# Altium schematic sheet cables.SchDoc: Hall / cables
size A4
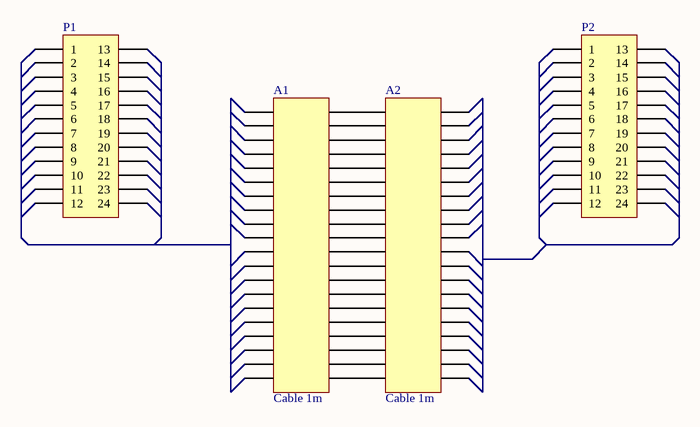
[diagram p0: cables.SchDoc]

## Parts
A1  Cable 1m  [HDR2X20]  (mechanical)
A2  Cable 1m  [HDR2X20]  (mechanical)
P1  wire connector  [HDR2X12_CEN]  (value not drawn)  (mechanical)
P2  wire connector  [HDR2X12_CEN]  (value not drawn)  (mechanical)

## Nets
NetA1_2: A1.2 A2.1
NetA1_4: A1.4 A2.3
NetA1_6: A1.6 A2.5
NetA1_8: A1.8 A2.7
NetA1_10: A1.10 A2.9
NetA1_12: A1.12 A2.11
NetA1_14: A1.14 A2.13
NetA1_16: A1.16 A2.15
NetA1_18: A1.18 A2.17
NetA1_20: A1.20 A2.19
NetA1_22: A1.22 A2.21
NetA1_24: A1.24 A2.23
NetA1_26: A1.26 A2.25
NetA1_28: A1.28 A2.27
NetA1_30: A1.30 A2.29
NetA1_32: A1.32 A2.31
NetA1_34: A1.34 A2.33
NetA1_36: A1.36 A2.35
NetA1_38: A1.38 A2.37
NetA1_40: A1.40 A2.39

Not connected (* = marked no-connect by the designer): A1 1 3 5 7 9 11 13 15 17 19 21 23 25 27 29 31 33 35 37 39; A2 2 4 6 8 10 12 14 16 18 20 22 24 26 28 30 32 34 36 38 40; P1 1 2 3 4 5 6 7 8 9 10 11 12 13 14 15 16 17 18 19 20 21 22 23 24; P2 1 2 3 4 5 6 7 8 9 10 11 12 13 14 15 16 17 18 19 20 21 22 23 24

## Notes on the sheet
- Title
- Size:
- Date:
- A4
- Number:
- Time:
- Revision:
- Sheet
- of
- Fermium LABS srl
- Via Monselice 15a
- 35142 Padova PD
- Italy
- File:

## Library data of the parts
A1 A2 = Header 20X2: cable, 1 meter; Manufacturer: HELUKABEL; Manufacturer Part Number: 21041; Unit: m; SuppliedAmount: 0; MinAmount: 5; Wire type: data transmission; Core structure: stranded; Core type: Cu; Number of cores: 20; No. of pairs: 10; Core section: 0.25mm<sup>2</sup>; Core marking: colours with colour repetition; Shield structure: tinned copper braid; Outer insulation material: PVC; Outside diameter: 10.6mm; Rated voltage: 350V; Wire series: LiYCY-P; Resistance to: most of oils; Cable features: twisted pair conductors; LatestRevisionDate: 17-Jul-2002; LatestRevisionNote: Re-released for DXP Platform.; Publisher: Altium Limited; Supplier 1: TME; Supplier Part Number 1: LIYCYP10X2X0.25; Category: Multicore Cables - Shielded; Stock 1: 105; Pricing 1: 5=3.35, 25=2.87, 50=2.56, 100=2.24 (EUR); Weight: 234; Multiples: 5; Insulation colour: grey; Operating temperature: -30...80°C; Flexibility class: 5; Price Type: NET; ComponentLink1URL: http://static.tme.eu/products_pics/6/d/b/6db3d8d6d88e3d48e6a1056796f437cb/283083.jpg; ComponentLink1Description: http://static.tme.eu/products_pics/6/d/b/6db3d8d6d88e3d48e6a1056796f437cb/283083.jpg
P1 P2 = Header 12X2A